# Altium schematic sheet MCU.SchDoc
size A4; SheetNumber: 1; SheetTotal: 4
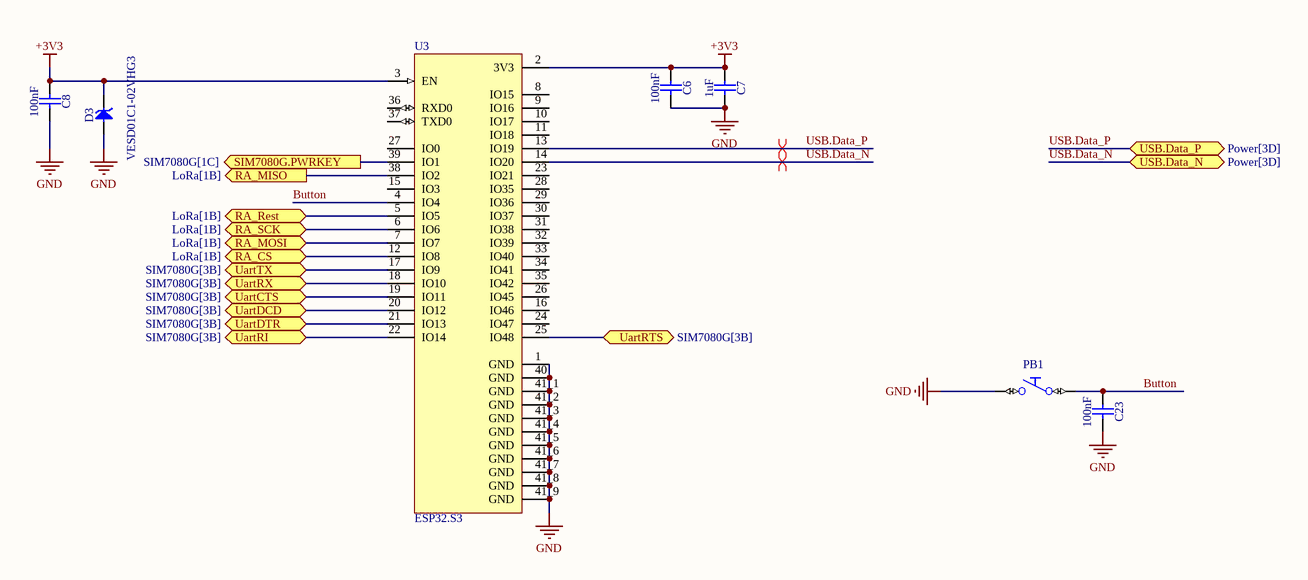
[diagram p0: MCU.SchDoc]

## Parts
C6  100nF  [CAPC1608X90N]
C7  1uF  [CAPC1608X90N]
C8  100nF  [CAPC1608X90N]
C23  100nF  [CAPC1608X90N]
D3  VESD01C1-02VHG3  [SODFL1608X70N]
PB1  Push Button  [PB_C&K_KSS221GLFS]  (value not drawn)
U3  ESP32.S3  [IC.ESP32.S3.WROOM.1U]

## Ports
RA_CS (bidir, see LoRa[1B]), RA_MISO (out, see LoRa[1B]), RA_MOSI (bidir, see LoRa[1B]), RA_Rest (bidir, see LoRa[1B]), RA_SCK (bidir, see LoRa[1B]), SIM7080G.PWRKEY (out, see SIM7080G[1C]), UartCTS (bidir, see SIM7080G[3B]), UartDCD (bidir, see SIM7080G[3B]), UartDTR (bidir, see SIM7080G[3B]), UartRI (bidir, see SIM7080G[3B]), UartRTS (bidir, see SIM7080G[3B]), UartRX (bidir, see SIM7080G[3B]), UartTX (bidir, see SIM7080G[3B]), USB.Data_N (bidir, see Power[3D]), USB.Data_P (bidir, see Power[3D])

## Nets
+3V3: C6.1 C7.1 C8.1 D3.1(C) U3.2(3V3) U3.3(EN)
GND: C6.2 C7.2 C8.2 C23.2 D3.2(A) PB1.2(NO) U3.1(GND) U3.40(GND) U3.41_1(GND) U3.41_2(GND) U3.41_3(GND) U3.41_4(GND) U3.41_5(GND) U3.41_6(GND) U3.41_7(GND) U3.41_8(GND) U3.41_9(GND)
Button: C23.1 PB1.1(C) U3.4(IO4)
RA_CS: U3.12(IO8) ; port RA_CS
RA_MISO: U3.38(IO2) ; port RA_MISO
RA_MOSI: U3.7(IO7) ; port RA_MOSI
RA_Rest: U3.5(IO5) ; port RA_Rest
RA_SCK: U3.6(IO6) ; port RA_SCK
SIM7080G.PWRKEY: U3.39(IO1) ; port SIM7080G.PWRKEY
UartCTS: U3.19(IO11) ; port UartCTS
UartDCD: U3.20(IO12) ; port UartDCD
UartDTR: U3.21(IO13) ; port UartDTR
UartRI: U3.22(IO14) ; port UartRI
UartRTS: U3.25(IO48) ; port UartRTS
UartRX: U3.18(IO10) ; port UartRX
UartTX: U3.17(IO9) ; port UartTX
USB.Data_N: U3.14(IO20) ; port USB.Data_N
USB.Data_P: U3.13(IO19) ; port USB.Data_P

Not connected (* = marked no-connect by the designer): U3 8(IO15) 9(IO16) 10(IO17) 11(IO18) 15(IO3) 16(IO46) 23(IO21) 24(IO47) 26(IO45) 27(IO0) 28(IO35) 29(IO36) 30(IO37) 31(IO38) 32(IO39) 33(IO40) 34(IO41) 35(IO42) 36(RXD0) 37(TXD0)

## Layout directives
differential pair: USB.Data_N, USB.Data_P

## Library data of the parts
C6 C8 C23 = CC0603_100NF_25V_20%_X5R_TDK_CGA3E2X5R1E104M080: Non-polarised capacitor; Part Description: SMD Multilayer Chip Ceramic Capacitor (Automotive Grade); Manufacturer: TDK; Voltage: 25V; TC: X5R; Tolerance: ±20%; Part Number: CC0603_100NF_25V_20%_X5R_TDK_CGA3E2X5R1E104M080; Component Kind: Standard; Component Type: Standard; Pin Count: 2; Value: 100nF; Status: Not Recommended; Manufacturer Part Number: CGA3E2X5R1E104M080; Case: 0603; Mounted: Yes; Socket: No; SMD: Yes; Sense: No; ComponentHeight: 0.9mm; HelpURL: \\cern.ch\dfs\Applications\Altium\Datasheets\CC0603_X5R_TDK_CGA(Up to 75V).pdf; Author: CERN DEM BC; CreateDate: 7/1/2020; LatestRevisionDate: 7/1/2020
C7 = CC0603_1UF_10V_10%_X5R: Non-polarised capacitor; Part Description: SMD Multilayer Chip Ceramic Capacitor; Manufacturer: GENERIC; Manufacturer1 Part Number: 0603ZD105KAT; Voltage: 10V; TC: X5R; Tolerance: ±10%; Part Number: CC0603_1UF_10V_10%_X5R; Component Kind: Standard; Component Type: Standard; Pin Count: 2; Value: 1uF; Status: None; Manufacturer Part Number: CC0603_1UF_10V_10%_X5R; Case: 0603; Mounted: Yes; Socket: No; SMD: Yes; Sense: No; Manufacturer1 Example: AVX; Manufacturer1 ComponentHeight: 0.9mm; HelpURL: \\cern.ch\dfs\Applications\Altium\Datasheets\CC0603_X5R_AVX_0603ZD105KAT.pdf; Author: CERN DEM HF; CreateDate: 7/10/2023; LatestRevisionDate: 7/10/2023
D3 = VESD01C1-02VHG3: Transient Voltage Suppressor Diode (Uni-Directional); Part Description: Single-Line ESD-Protection (30kV) Diode; Manufacturer: VISHAY SEMICONDUCTORS; Voltage: 1V; Power: 100W; PressFit: No; Bonding: No; Part Number: VESD01C1-02VHG3; Component Kind: Standard; Component Type: Standard; Device: VESD01C1-02VHG3; PackageDescription: SODFL (SOD-523) Diode; 1.20mm W X 0.80mm L X 0.70mm H body, IPC Medium Density; Manufacturer Part Number: VESD01C1-02VHG3; Pin Count: 2; Case: SOD-523; Mounted: Yes; Socket: No; SMD: Yes; Sense: No; ComponentHeight: 0.7mm; HelpURL: \\cern.ch\dfs\Applications\Altium\Datasheets\VESD01C1-02VHG3.pdf; Author: CERN DEM BC; CreateDate: 5/19/2020; LatestRevisionDate: 5/19/2020
PB1 = PB_C&K_KSS221GLFS: Push-Button Switch SPST; Part Description: 32VDC 50mA SPST-NO Surface Mount Subminiature Tact Momentary Side Actuated Pushbutton Switch, Operating Force 2N; Manufacturer: C&K; PressFit: No; Sense Comment: Non-washable; Part Number: PB_C&K_KSS221GLFS; Component Kind: Standard; Component Type: Standard; Pin Count: 2; PackageDescription: Body 7.0x3.5mm, Surface Mount Subminiature Tact Side Actuated Switch, C&K KSS Series; Family: Push Button; Mounted: Yes; Socket: No; SMD: Yes; Sense: Yes; Status: None; Manufacturer Part Number: KSS221GLFS; ComponentHeight: 1.7mm; HelpURL: \\cern.ch\dfs\Applications\Altium\Datasheets\PB_C&K_KSS221GLFS.pdf; Author: CERN DEM BC; CreateDate: 12/2/2019; LatestRevisionDate: 12/2/2019
U3 = IC.ESP32.S3.WROOM.1U: 2.4 GHz Wi-Fi (802.11b/g/n) and Bluetooth® 5 module / Built around ESP32-S3 series of SoCs, Xtensa® dual-core 32-bit LX7 microprocessor / Flash up to 16 MB, PSRAM up to 16 MB / Up to 36 GPIOs, rich set of peripherals / On-board PCB antenna or external antenna connector; ComponentLink1Description: DataSheet; ComponentLink1URL: https://www.espressif.com/sites/default/files/documentation/esp32-s3-wroom-1_wroom-1u_datasheet_en.pdf